# EAGLE design BLE112 Coin Board v1.0 (EAGLE 6.3)
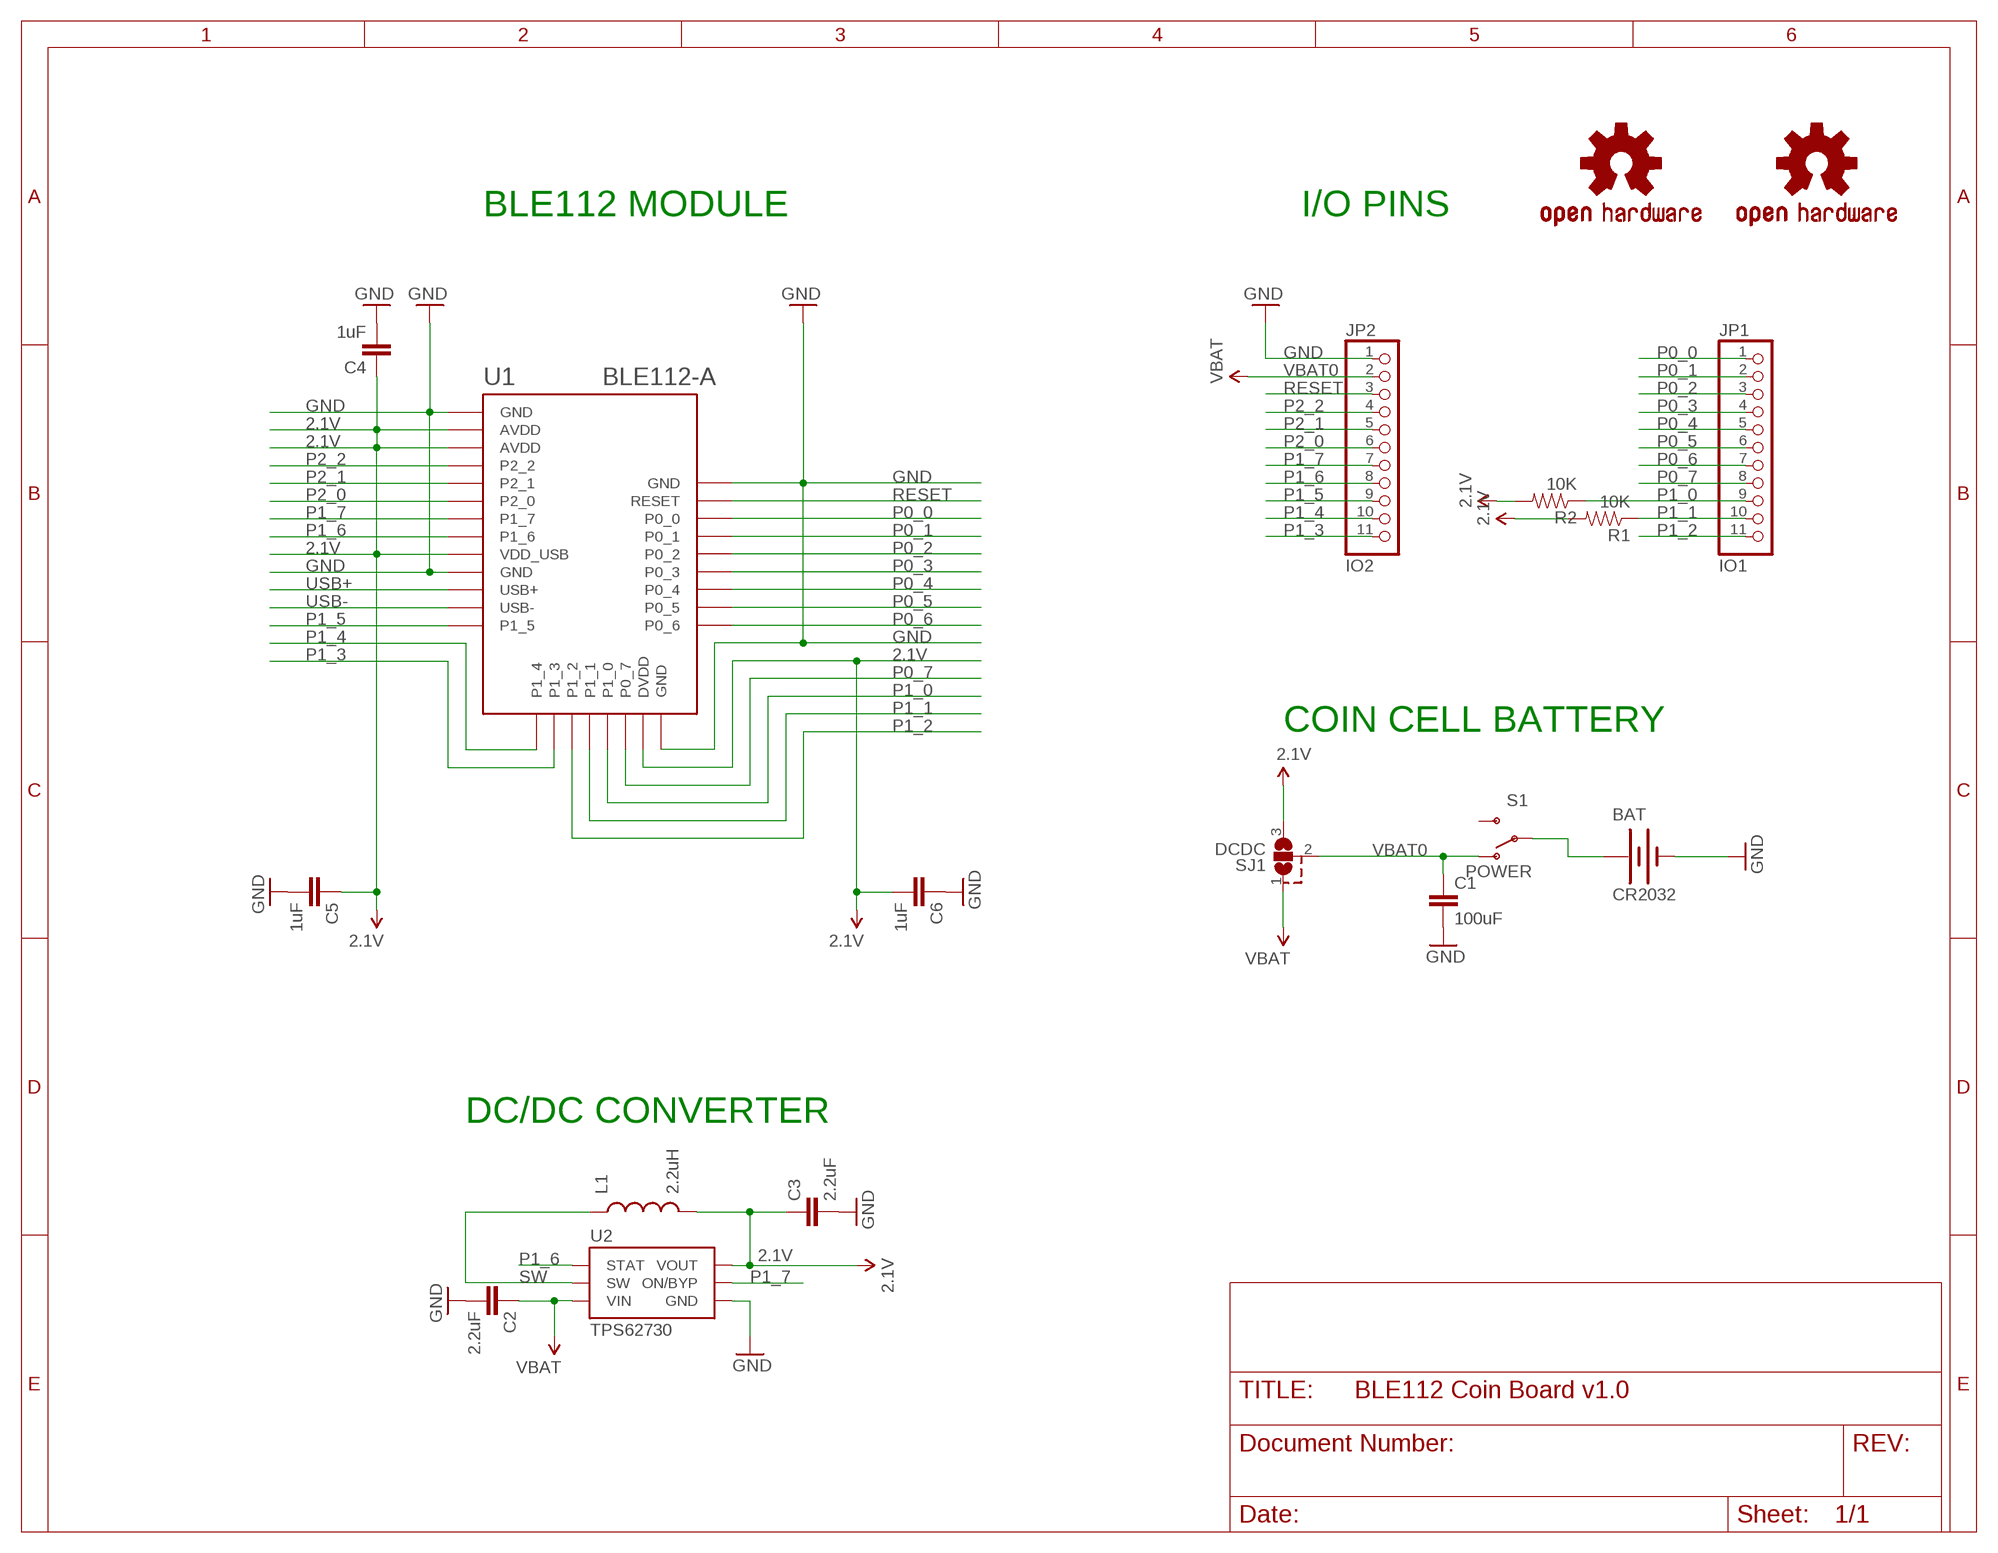
[diagram p0: schematic, sheet 1]

## Parts
BAT  CR2032  BATTERY20MM_4LEGS  [BATTCON_20MM_4LEGS]
C1  100uF  CAP0805  [0805]
C2  2.2uF  CAP0603-CAP  [0603-CAP]
C3  2.2uF  CAP0603-CAP  [0603-CAP]
C4  1uF  CAP0603-CAP  [0603-CAP]
C5  1uF  CAP0603-CAP  [0603-CAP]
C6  1uF  CAP0603-CAP  [0603-CAP]
JP1  IO1  PINHD-1X11  [1X11]
JP2  IO2  PINHD-1X11  [1X11]
L1  2.2uH  INDUCTOR0603  [0603]
R1  10K  RESISTOR0603-RES  [0603-RES]
R2  10K  RESISTOR0603-RES  [0603-RES]
S1  POWER  SWITCH-SPST-SMD-A  [SWITCH-SPST-SMD-A]
SJ1  DCDC  SJ2-TRACE  [SJ2-TRACE]
U1  BLE112-A  BLE112-A-VISUAL  [BLE112-A]
U2  TPS62730  [TPS62730]
U$1  OSHW-LOGOS  [OSHW-LOGO-S]
U$2  OSHW-LOGOS  [OSHW-LOGO-S]

## Nets
2.1V [power]: C3.1 C4.1 C5.1 C6.2 L1.2 R1.2 R2.2 SJ1.3 U1.AVDD1(AVDD) U1.AVDD2(AVDD) U1.DVDD U1.VDD_USB U2.VOUT
GND [power]: BAT.2(-) C1.2 C2.2 C3.2 C4.2 C5.2 C6.1 JP2.1 U1.GND1(GND) U1.GND2(GND) U1.GND3(GND) U1.GND4(GND) U2.GND
N$1 [power]: BAT.1(+) S1.2(P)
P0_0: JP1.1 U1.P0_0
P0_1: JP1.2 U1.P0_1
P0_2: JP1.3 U1.P0_2
P0_3: JP1.4 U1.P0_3
P0_4: JP1.5 U1.P0_4
P0_5: JP1.6 U1.P0_5
P0_6: JP1.7 U1.P0_6
P0_7: JP1.8 U1.P0_7
P1_0: JP1.9 R2.1 U1.P1_0
P1_1: JP1.10 R1.1 U1.P1_1
P1_2: JP1.11 U1.P1_2
P1_3: JP2.11 U1.P1_3
P1_4: JP2.10 U1.P1_4
P1_5: JP2.9 U1.P1_5
P1_6: JP2.8 U1.P1_6 U2.STAT
P1_7: JP2.7 U1.P1_7 U2.ON/BYP
P2_0: JP2.6 U1.P2_0
P2_1: JP2.5 U1.P2_1
P2_2: JP2.4 U1.P2_2
RESET: JP2.3 U1.RESET
SW: L1.1 U2.SW
USB+: U1.USB+
USB-: U1.USB-
VBAT [power]: C2.1 SJ1.1 U2.VIN
VBAT0 [power]: C1.1 JP2.2 S1.1(O) SJ1.2 ; supply symbol labelled VBAT
Unconnected: S1.3(S)

## Notes on the sheet
- BLE112 MODULE | I/O PINS
- COIN CELL BATTERY
- DC/DC CONVERTER

## Library data of the parts
BAT = SparkFun:BATTERY: Battery Holders Various common sizes : AA, AAA, 20mm coin cell and 12mm coin cell.
C1-C6 = SparkFun:CAP: Capacitor Standard 0603 ceramic capacitor, and 0.1" leaded capacitor.
JP1 JP2 = sf-pinhead:PINHD-1X11: PIN HEADER
L1 = SparkFun:INDUCTOR: Inductors Basic Inductor/Choke - 0603 and 1206. Footprints are not proven and vary greatly between part numbers.
R1 R2 = SparkFun:RESISTOR: Resistor Basic schematic elements and footprints for 0603, 1206, and PTH resistors.
S1 = SparkFun:SWITCH-SPST: SPST Switch Simple slide switch. Spark Fun Electronics SKU : COM-00102
SJ1 = sf-keyglove:SJ2-TRACE: SMD solder JUMPER
U1 = sf-bluegiga:BLE112-A-VISUAL: Bluetooth Low Energy single-mode module - Bluetooth 4.0, chip antenna
U2 = sf-keyglove:TPS62730
U$1 U$2 = SparkFun:OSHW-LOGO: Open Source Hardware Logo This logo indicates the piece of hardware it is found on incorporates a OSHW license and/or adheres to the definition of open source hardware found here: http://freedomdefined.org/OSHW

## Net classes
0 default: width 0.152 mm, drill 0.33 mm, clearance 0.152 mm
1 power: width 0.254 mm, drill 0.33 mm, clearance 0.152 mm

## Board
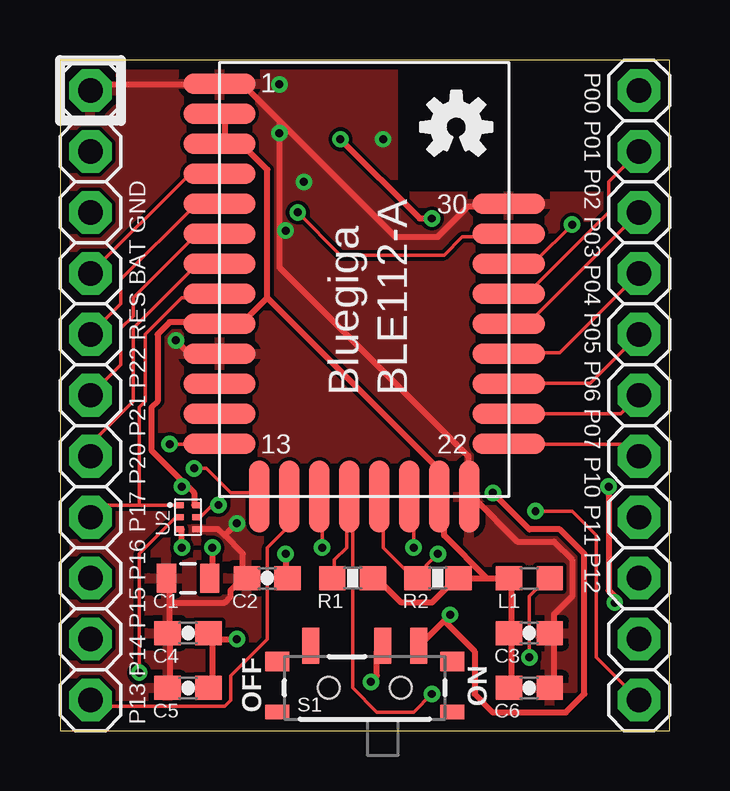
[diagram p1: board, top side]
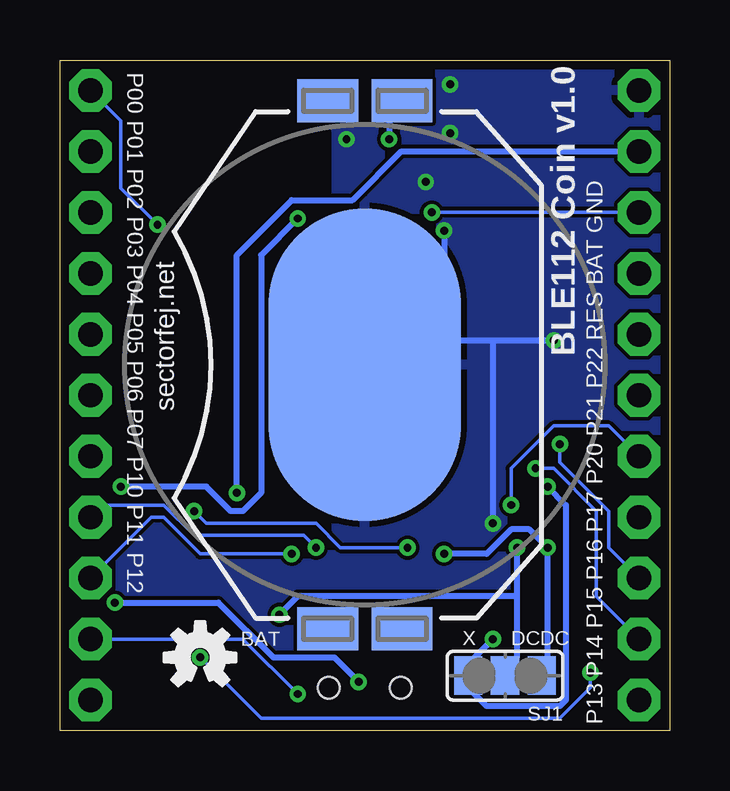
[diagram p2: board, bottom side, seen from below]

Size 25.4 x 27.94 mm. Coordinates in mm from the lower left corner, seen from the top.
Outline: 0,0 25.4,0 25.4,27.94 0,27.94 0,0
Copper layers (1*16): Top 0.0356mm / dielectric 1.5011mm / Bottom 0.0356mm
Design rules "default": minimum track width 6mil, minimum drill 13mil, track to track 6mil, track to pad 6mil, pad to pad 6mil, via to via 6mil, smd to smd 6mil, copper to edge 15mil, drill to drill 6mil, minimum pad ring 7mil, minimum via ring 7mil, stop-mask expansion 4mil, vias tented up to drill 13mil, thermal gap 10mil
tRestrict: area 14.1,22.5 to 22.4,27.9
bRestrict: area 14.1,22.5 to 22.4,27.9

### Footprints (pad centres in the part's own frame; a part is rotated, then mirrored left to right if it is on the bottom)
BATTCON_20MM_4LEGS = smd 1.778 x 2.54: 1 -11,1.55; 3 11,1.55; P$1 -11,-1.55; P$2 11,-1.55 | smd 13 x 8: 2 0,0
0805 = smd 0.8 x 1.2: 1 -0.9,0; 2 0.9,0
0603-CAP = smd 1.1 x 1: 1 -0.85,0; 2 0.85,0
1X11 = drill 1.016 pad 1.778 octagon: 1 -12.7,0; 2 -10.16,0; 3 -7.62,0; 4 -5.08,0; 5 -2.54,0; 6 0,0; 7 2.54,0; 8 5.08,0; 9 7.62,0; 10 10.16,0; 11 12.7,0
0603 = smd 1.1 x 1: 1 -0.85,0; 2 0.85,0
0603-RES = smd 1.1 x 1: 1 -0.85,0; 2 0.85,0
SWITCH-SPST-SMD-A = smd 0.7 x 1.5: 1 -2.25,-1.75; 2 -0.75,-1.75; 3 2.25,-1.75 | smd 1 x 0.6: GND1 -3.65,1; GND3 3.65,1 | smd 1 x 0.8: GND2 -3.65,-1.1; GND4 3.65,-1.1 | hole 0.9: -1.5,0; 1.5,0
SJ2-TRACE = smd 1.168 x 1.6: 1 -1.524,0; 2 0,0; 3 1.524,0 | smd 0.762 x 0.152: TRACE -0.762,0
BLE112-A = smd 3 x 0.85: AVDD1 -6.05,6.9; AVDD2 -6.05,5.65; GND1 -6.05,8.15; GND2 -6.05,-3.1; GND4 6,3.15; P0_0 6,0.65; P0_1 6,-0.6; P0_2 6,-1.85; P0_3 6,-3.1; P0_4 6,-4.35; P0_5 6,-5.6; P0_6 6,-6.85; P1_5 -6.05,-6.85; P1_6 -6.05,-0.6; P1_7 -6.05,0.65; P2_0 -6.05,1.9; P2_1 -6.05,3.15; P2_2 -6.05,4.4; RESET 6,1.9; USB+ -6.05,-4.35; USB- -6.05,-5.6; VDD_USB -6.05,-1.85 | smd 0.85 x 3: DVDD 3.1,-9.05; GND3 4.35,-9.05; P0_7 1.85,-9.05; P1_0 0.6,-9.05; P1_1 -0.65,-9.05; P1_2 -1.9,-9.05; P1_3 -3.15,-9.05; P1_4 -4.4,-9.05
TPS62730 = smd 0.35 x 0.25: GND 0.35,-0.5; ON/BYP 0.35,0; STAT -0.35,0.5; SW -0.35,0; VIN -0.35,-0.5; VOUT 0.35,0.5

### Placement (x,y rotation side)
BAT  12.7,15.24 270 bottom
C1  5.33,6.35 180 top
C2  8.64,6.35 180 top
C3  19.56,4.06 0 top
C4  5.33,4.06 180 top
C5  5.33,1.78 180 top
C6  19.56,1.78 180 top
JP1  24.13,13.97 270 top
JP2  1.27,13.97 270 top
L1  19.56,6.35 180 top
R1  12.19,6.35 0 top
R2  15.75,6.35 0 top
S1  12.7,1.78 180 top
SJ1  6.86,2.29 180 bottom
U1  12.7,18.8 0 top
U2  5.33,8.89 0 top
U$1  19.56,3.05 0 bottom
U$2  16.51,25.15 0 top

### Tracks (layer width: path | path; a pad name or v marks a point on that pad's centre or on a via)
2.1V  (via drill 0.33)
  Top 0.254: 18.8,4.06 18.8,1.78 C6.2 | R1.2 13.21,6.35 14.22,5.33 15.49,5.33 16.51,6.35 R2.2 17.78,6.35 | 17.78,6.35 L1.2 18.8,6.35 18.8,4.06 | 18.8,4.06 C3.1 | 17.78,6.35 16,8.13 16,9.65 U1.DVDD 15.75,9.91 15.75,10.92 8.64,18.03 | U1.AVDD1 6.86,25.65 6.86,24.64 U1.AVDD2 6.86,24.38 7.62,24.38 8.64,23.37 8.64,18.03 | 6.35,3.81 6.35,4.06 C4.1 6.35,3.81 | 6.35,3.81 6.35,1.78 C5.1 | 6.35,3.81 v7.37,3.81 | 5.08,10.41 3.81,11.68 3.81,13.46 4.06,13.72 4.06,16.51 4.57,17.02 6.6,17.02 U1.VDD_USB 6.86,17.02 7.62,17.02 8.64,18.03 | 5.08,10.41 5.59,9.91 5.59,9.4 U2.VOUT | 5.08,10.41 v5.08,10.16
  Bottom 0.254: v7.37,3.81 8.38,2.79 SJ1.3 8.38,1.78 7.62,1.02 4.57,1.02 4.32,1.27 4.32,9.4 v5.08,10.16
GND  (via drill 0.33)
  Top 0.254: 6.86,8.13 7.62,7.37 7.62,6.35 | 6.86,8.13 6.6,8.38 5.84,8.38 U2.GND | 4.57,4.06 4.57,1.78 C5.2 | 4.57,4.06 4.57,5.33 | 4.57,5.33 4.57,6.35 C1.2 | 4.57,4.06 C4.2 | 7.62,6.35 7.11,5.84 7.11,5.59 6.86,5.33 4.57,5.33 | 7.62,6.35 C2.2 | v4.83,16.26 5.33,15.75 6.6,15.75 U1.GND2 | v7.37,8.64 6.86,8.13 | 20.57,4.06 20.57,1.78 C6.1 | 20.57,4.06 20.57,4.83 21.34,5.59 21.34,7.11 20.57,7.87 19.05,7.87 17.27,9.65 U1.GND3 17.02,9.91 17.02,11.43 9.14,19.3 9.14,20.83 | 20.57,4.06 C3.2 | JP2.1 1.52,26.92 6.6,26.92 U1.GND1 6.86,26.92 7.62,26.92 9.14,25.4 | 9.14,25.4 13.97,20.57 15.75,20.57 17.02,21.84 18.54,21.84 U1.GND4 | 9.14,25.4 9.14,20.83 | 9.14,20.83 v9.4,20.83
  Bottom 0.254: 9.4,16.26 11.68,16.26 BAT.2 9.4,16.26 | 9.4,16.26 7.37,16.26 | 7.37,16.26 v4.83,16.26 | 7.37,16.26 v7.37,8.64 | v9.4,20.83 9.4,16.26
  other vias: 10.16,22.86 13.46,24.64 9.14,24.89 9.14,26.92
  pour Bottom: 25.4,27.94 0,27.94 0,0 25.4,0
  pour Top: 25.4,27.94 0,27.94 0,0 25.4,0
N$1  (via drill 0.33)
  Top 0.254: v12.95,2.03 13.21,2.29 13.21,3.3 S1.2 | v23.11,5.33 23.11,5.59 22.86,5.84 v22.86,10.16 | v15.49,21.34 14.99,21.34 v11.68,24.64
  Bottom 0.254: v12.95,2.03 13.97,3.05 16.51,3.05 18.8,5.33 v23.11,5.33 | v22.86,10.16 19.3,10.16 18.29,9.14 17.78,9.14 17.02,9.91 17.02,19.81 v15.49,21.34 | v11.68,24.64 11.68,25.65 11.18,26.16 BAT.1
P0_0  (via drill 0.33)
  Top 0.152: v21.34,21.08 19.81,19.56 18.8,19.56 U1.P0_0
  Bottom 0.152: v21.34,21.08 22.86,22.61 22.86,25.4 JP1.1
P0_1
  Top 0.152: JP1.2 22.86,22.86 22.86,21.59 19.56,18.29 18.8,18.29 U1.P0_1
P0_2
  Top 0.152: JP1.3 19.56,17.02 18.8,17.02 U1.P0_2
P0_3
  Top 0.152: JP1.4 20.83,15.75 18.8,15.75 U1.P0_3
P0_4
  Top 0.152: JP1.5 22.1,14.48 18.8,14.48 U1.P0_4
P0_5
  Top 0.152: JP1.6 23.37,13.21 18.8,13.21 U1.P0_5
P0_6
  Top 0.152: JP1.7 23.62,11.94 18.8,11.94 U1.P0_6
P0_7  (via drill 0.33)
  Top 0.152: v14.73,7.62 14.73,9.65 U1.P0_7
  Bottom 0.152: v14.73,7.62 15.24,8.13 19.81,8.13 21.08,9.4 23.62,9.4 JP1.8
P1_0  (via drill 0.33)
  Top 0.152: 14.73,6.35 13.46,7.62 13.46,9.65 U1.P1_0 | 14.73,6.35 v15.75,7.37 | 14.73,6.35 R2.1
  Bottom 0.152: JP1.9 21.59,8.89 21.08,8.89 19.56,7.37 v15.75,7.37
P1_1  (via drill 0.33)
  Top 0.152: R1.1 11.43,6.35 11.43,7.11 11.94,7.62 11.94,9.65 U1.P1_1 12.19,9.65 12.19,1.78 13.21,0.76 14.73,0.76 v15.49,1.52
  Bottom 0.152: JP1.10 17.78,3.81 v15.49,1.52
P1_2  (via drill 0.33)
  Top 0.152: v10.92,7.62 10.92,9.65 U1.P1_2 | v19.81,9.14 21.34,9.14 22.35,8.13 22.35,3.05 JP1.11
  Bottom 0.152: v10.92,7.62 13.72,7.62 14.73,8.64 19.3,8.64 v19.81,9.14
P1_3
  Top 0.152: JP2.11 1.52,1.02 6.86,1.02 7.11,1.27 7.11,2.29 8.64,3.81 8.64,7.62 9.4,8.38 9.4,9.65 U1.P1_3
P1_4  (via drill 0.33)
  Top 0.152: v5.59,10.92 6.1,10.92 7.11,9.91 8.13,9.91 U1.P1_4
  Bottom 0.152: v5.59,10.92 4.83,10.92 3.05,9.14 3.05,5.59 JP2.10
P1_5  (via drill 0.33)
  Top 0.152: v4.57,11.94 6.6,11.94 U1.P1_5
  Bottom 0.152: v4.57,11.94 4.57,11.18 2.54,9.14 2.54,7.62 JP2.9
P1_6
  Top 0.152: 3.3,9.4 1.78,9.4 JP2.8 | 3.3,9.4 4.83,9.4 U2.STAT | 3.3,9.4 3.3,13.46 3.56,13.72 3.56,16.51 5.08,18.03 6.6,18.03 U1.P1_6
P1_7  (via drill 0.33)
  Top 0.152: v6.6,9.4 6.35,9.4 5.84,8.89 U2.ON/BYP | JP2.7 1.27,11.94 3.05,13.72 3.05,16.76 5.59,19.3 6.6,19.3 U1.P1_7
  Bottom 0.152: v6.6,9.4 6.6,10.92 4.83,12.7 2.54,12.7 JP2.7
P2_0
  Top 0.152: JP2.6 2.54,15.24 2.54,16.76 3.05,17.27 3.05,18.03 5.59,20.57 6.6,20.57 U1.P2_0
P2_1
  Top 0.152: JP2.5 2.54,17.78 2.54,18.8 5.59,21.84 6.6,21.84 U1.P2_1
P2_2
  Top 0.152: JP2.4 5.33,23.11 6.6,23.11 U1.P2_2
RESET  (via drill 0.33)
  Top 0.152: v9.91,21.59 11.68,19.81 16,19.81 16.76,20.57 18.54,20.57 U1.RESET
  Bottom 0.152: JP2.3 v9.91,21.59
SW  (via drill 0.33)
  Top 0.152: v3.3,2.41 3.3,7.37 4.83,8.89 U2.SW | v19.56,3.05 19.56,5.59 20.32,6.35 L1.1
  Bottom 0.152: v3.3,2.41 3.3,1.78 4.57,0.51 17.02,0.51 v19.56,3.05
VBAT  (via drill 0.33)
  Top 0.254: v5.08,7.62 5.08,8.38 U2.VIN | v9.4,7.37 9.4,6.35 C2.1
  Bottom 0.254: SJ1.1 5.08,2.54 v5.08,7.62 5.84,8.38 6.6,8.38 7.62,7.37 v9.4,7.37
VBAT0  (via drill 0.33)
  Top 0.254: v6.35,7.62 6.35,6.35 C1.1 | v16.26,4.83 16,4.57 | 16,4.57 14.99,3.56 S1.1 | v18.03,9.91 19.56,8.38 20.83,8.38 21.84,7.37 21.84,1.52 21.08,0.76 18.03,0.76 17.27,1.52 17.27,3.3 16,4.57
  Bottom 0.254: 6.35,5.59 6.35,3.05 6.86,2.54 SJ1.2 | 6.35,5.59 v6.35,7.62 | v16.26,4.83 15.49,5.59 6.35,5.59 | JP2.2 11.18,24.13 13.21,22.1 15.75,22.1 18.03,19.81 v18.03,9.91

### Text on the board
tPlace: P00 P01 P02 P03 P04 P05 P06 P07 P10 P11 P12 | Bluegiga | BLE112-A | OFF | ON | P13 P14 P15 P16 P17 P20 P21 P22 RES BAT GND
bPlace: BLE112 Coin v1.0 | P00 P01 P02 P03 P04 P05 P06 P07 P10 P11 P12 | sectorfej.net | DCDC | X | P13 P14 P15 P16 P17 P20 P21 P22 RES BAT GND